# Altium schematic sheet Force.SchDoc
size A; Organization: Altium Limited; Address1: L3, 12a Rodborough Rd; Address2: Frenchs Forest; Address3: NSW; Address4: Australia 2086
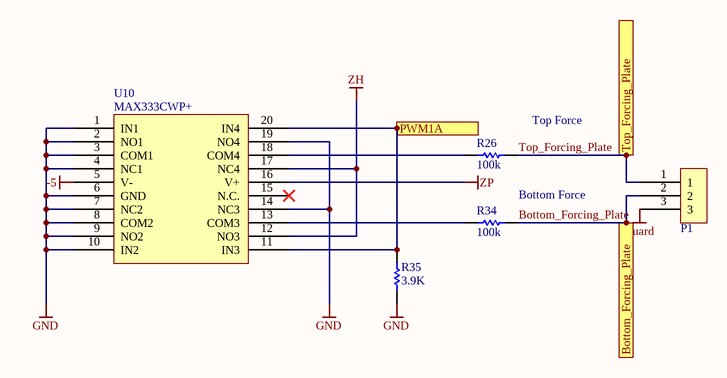
[diagram p0: Force.SchDoc]

## Parts
P1  Triax_Conn  [Triax_Conn]  (value not drawn)
R26  100k  [RESC0402(1005)_M]
R34  100k  [RESC0402(1005)_M]
R35  3.9K  [RESC0402(1005)_M]
U10  MAX333CWP+  [TSOP65P640X90-20N]

## Ports
Bottom_Forcing_Plate, PWM1A, Top_Forcing_Plate

## Nets
-5: U10.5(V-)
GND: R35.1 U10.1(IN1) U10.2(NO1) U10.3(COM1) U10.4(NC1) U10.6(GND) U10.7(NC2) U10.8(COM2) U10.9(NO2) U10.10(IN2) U10.14(NC3) U10.19(NO4)
Guard: P1.3
ZH: U10.12(NO3) U10.17(NC4)
ZP: U10.16(V+)
Bottom_Forcing_Plate: P1.2 R34.1 ; port Bottom_Forcing_Plate
PWM1A: R35.2 U10.11(IN3) U10.20(IN4) ; port PWM1A
Top_Forcing_Plate: P1.1 R26.1 ; port Top_Forcing_Plate
NetR26_2: R26.2 U10.18(COM4)
NetR34_2: R34.2 U10.13(COM3)

Not connected (* = marked no-connect by the designer): U10 15(N.C.)*

## Notes on the sheet
- (near R26) Top Force
- Bottom Force
- Title
- Size:
- Date:
- A
- Number:
- Time:
- Revision:
- Sheet
- of
- File:

## Library data of the parts
R26 R34 = CMP-1011-00651-1
R35 = CMP-1011-00463-1
U10 = MAX333CWP+: IC SWITCH QUAD SPDT 20TSSOP; Manufacturer: Maxim; Manufacturer Part Number: MAX333AEUP+; Max Supply Voltage: 30V; Min Supply Voltage: 10V; Min Dual Supply Voltage: 4.5V; Max Dual Supply Voltage: 20V; On-State Resistance: 35R; Operating Supply Current: 1uA; Supply Type: Single,Dual; Max Power Dissipation: 559mW; Turn-On Delay Time: 175ns; Turn-Off Delay Time: 145ns; Max Supply Current: 250uA; Number of Bits: 4; Dual Supply Voltage: 15V; Supplier 1: Mouser; Supplier Part Number 1: 700-MAX333AEUP; Stock 1: 664; Pricing 1: 1=6.77, 10=6.43, 50=5.8, 100=5.8, 1000=5.62, 10000=5.62 (USD); Case/Package: TSSOP; Number of Pins: 20; Weight: 0.006737oz; Min Operating Temperature: -40°C; Max Operating Temperature: 85°C; Packaging: Rail/Tube; Package Quantity: 74; Throw Configuration: SPDT; Number of Channels: 4; Length: 6.6mm; Height: 0.95mm; Width: 4.5mm; Radiation Hardening: No; Lead Free: Lead Free; REACH SVHC: Unknown; ComponentLink1URL: https://datasheet.ciiva.com/2978/max333a-2978850.pdf; ComponentLink1Description: https://datasheet.ciiva.com/2978/max333a-2978850.pdf; ComponentLink2URL: https://datasheet.ciiva.com/30478/0900766b81253c85-30478260.pdf; ComponentLink2Description: https://datasheet.ciiva.com/30478/0900766b81253c85-30478260.pdf; ComponentLink3URL: https://datasheet.ciiva.com/1674/max333a-1674617.pdf; ComponentLink3Description: https://datasheet.ciiva.com/1674/max333a-1674617.pdf; ComponentLink4URL: https://datasheet.ciiva.com/26825/max333aeup-26825546.pdf; ComponentLink4Description: https://datasheet.ciiva.com/26825/max333aeup-26825546.pdf